# EAGLE design Environmental Module (EAGLE 8.3.0)
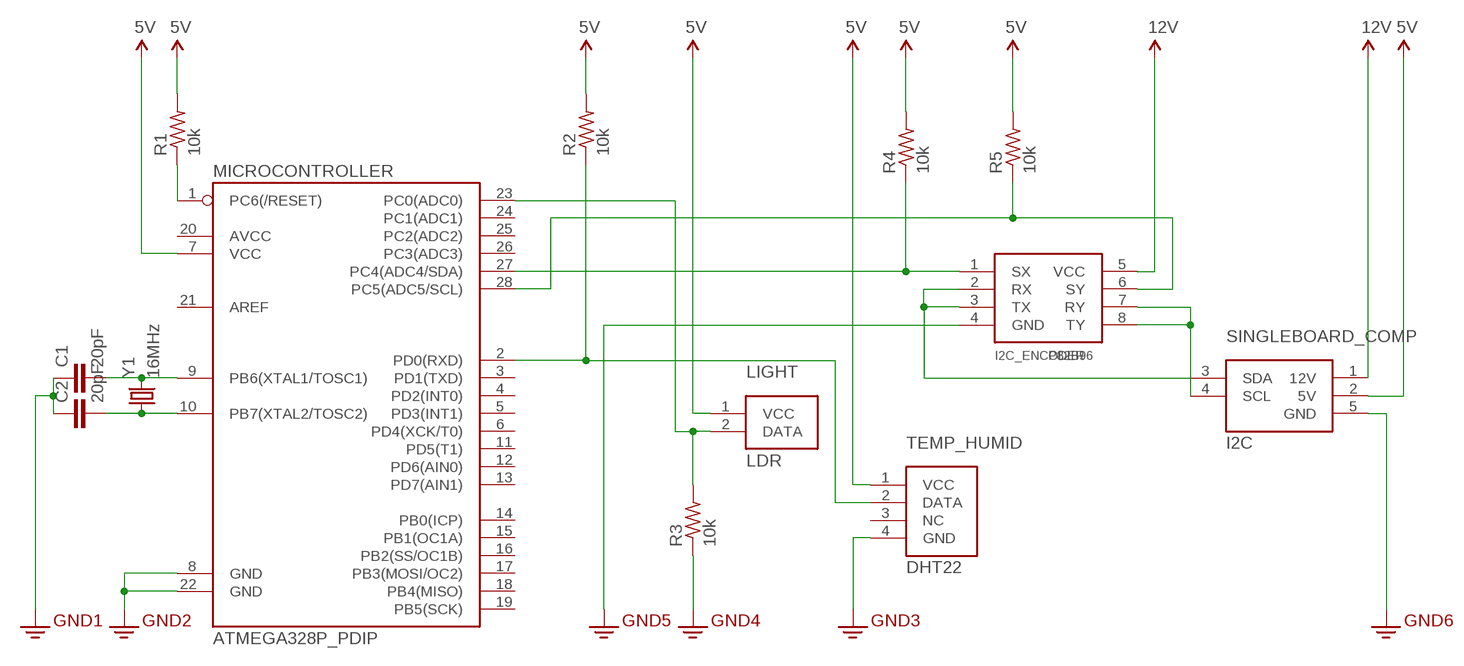
[diagram p0: schematic, sheet 1]

## Parts
C1  20pF  CAPPTH  [CAP-PTH-SMALL]
C2  20pF  CAPPTH  [CAP-PTH-SMALL]
I2C_ENCODER  P82B96  [DIP08]
LIGHT  LDR  [LDR]
MICROCONTROLLER  ATMEGA328P_PDIP  [DIL28-3]
R1  10k  R-US_0204/7  [0204/7]
R2  10k  R-US_0204/7  [0204/7]
R3  10k  R-US_0204/7  [0204/7]
R4  10k  R-US_0204/7  [0204/7]
R5  10k  R-US_0204/7  [0204/7]
SINGLEBOARD_COMP  I2C  [I2C_TERM]
TEMP_HUMID  DHT22  [DHT22]
Y1  16MHz  CRYSTALHC49US  [HC49US]

## Nets
3.3V: C1.1 C2.1 I2C_ENCODER.4(GND) MICROCONTROLLER.8(GND) MICROCONTROLLER.22(GND) R3.1 SINGLEBOARD_COMP.5(GND) TEMP_HUMID.4(GND) ; supply symbol labelled GND2
5V: LIGHT.1(VCC) MICROCONTROLLER.7(VCC) R1.2 R2.2 R4.2 R5.2 SINGLEBOARD_COMP.2(5V) TEMP_HUMID.1(VCC)
12V: I2C_ENCODER.5(VCC) SINGLEBOARD_COMP.1(12V)
N$2: I2C_ENCODER.6(SY) MICROCONTROLLER.28(PC5(ADC5/SCL)) R5.1
N$3: MICROCONTROLLER.1(PC6(/RESET)) R1.1
N$4: I2C_ENCODER.7(RY) I2C_ENCODER.8(TY) SINGLEBOARD_COMP.4(SCL)
N$5: I2C_ENCODER.1(SX) MICROCONTROLLER.27(PC4(ADC4/SDA)) R4.1
N$9: MICROCONTROLLER.2(PD0(RXD)) R2.1 TEMP_HUMID.2(DATA)
N$10: LIGHT.2(DATA) MICROCONTROLLER.23(PC0(ADC0)) R3.2
N$11: I2C_ENCODER.2(RX) I2C_ENCODER.3(TX) SINGLEBOARD_COMP.3(SDA)
N$12: C2.2 MICROCONTROLLER.10(PB7(XTAL2/TOSC2)) Y1.1
N$20: C1.2 MICROCONTROLLER.9(PB6(XTAL1/TOSC1)) Y1.2
Unconnected: MICROCONTROLLER.3(PD1(TXD)) MICROCONTROLLER.4(PD2(INT0)) MICROCONTROLLER.5(PD3(INT1)) MICROCONTROLLER.6(PD4(XCK/T0)) MICROCONTROLLER.11(PD5(T1)) MICROCONTROLLER.12(PD6(AIN0)) MICROCONTROLLER.13(PD7(AIN1)) MICROCONTROLLER.14(PB0(ICP)) MICROCONTROLLER.15(PB1(OC1A)) MICROCONTROLLER.16(PB2(SS/OC1B)) MICROCONTROLLER.17(PB3(MOSI/OC2)) MICROCONTROLLER.18(PB4(MISO)) MICROCONTROLLER.19(PB5(SCK)) MICROCONTROLLER.20(AVCC) MICROCONTROLLER.21(AREF) MICROCONTROLLER.24(PC1(ADC1)) MICROCONTROLLER.25(PC2(ADC2)) MICROCONTROLLER.26(PC3(ADC3)) TEMP_HUMID.3(NC)

## Library data of the parts
C1 C2 = SparkFun-Capacitors:CAP: Capacitor Standard 0603 ceramic capacitor, and 0.1" leaded capacitor.
I2C_ENCODER = 003_P82B96:P82B96: P82B96 - I2C buffer
LIGHT = 000_CropQuant:LDR
MICROCONTROLLER = SparkFun-DigitalIC:ATMEGA328P_PDIP: uC used in the Arduino 32kb flash, 1k EEPROM, 2k SRAM This is the through-hole version of this chip.
R1-R5 = resistor:R-US_: RESISTOR, American symbol
SINGLEBOARD_COMP = 000_CropQuant:I2C
TEMP_HUMID = 000_CropQuant:DHT22
Y1 = SparkFun-FreqCtrl:CRYSTAL: Various standard crystals. Proven footprints.

## Board
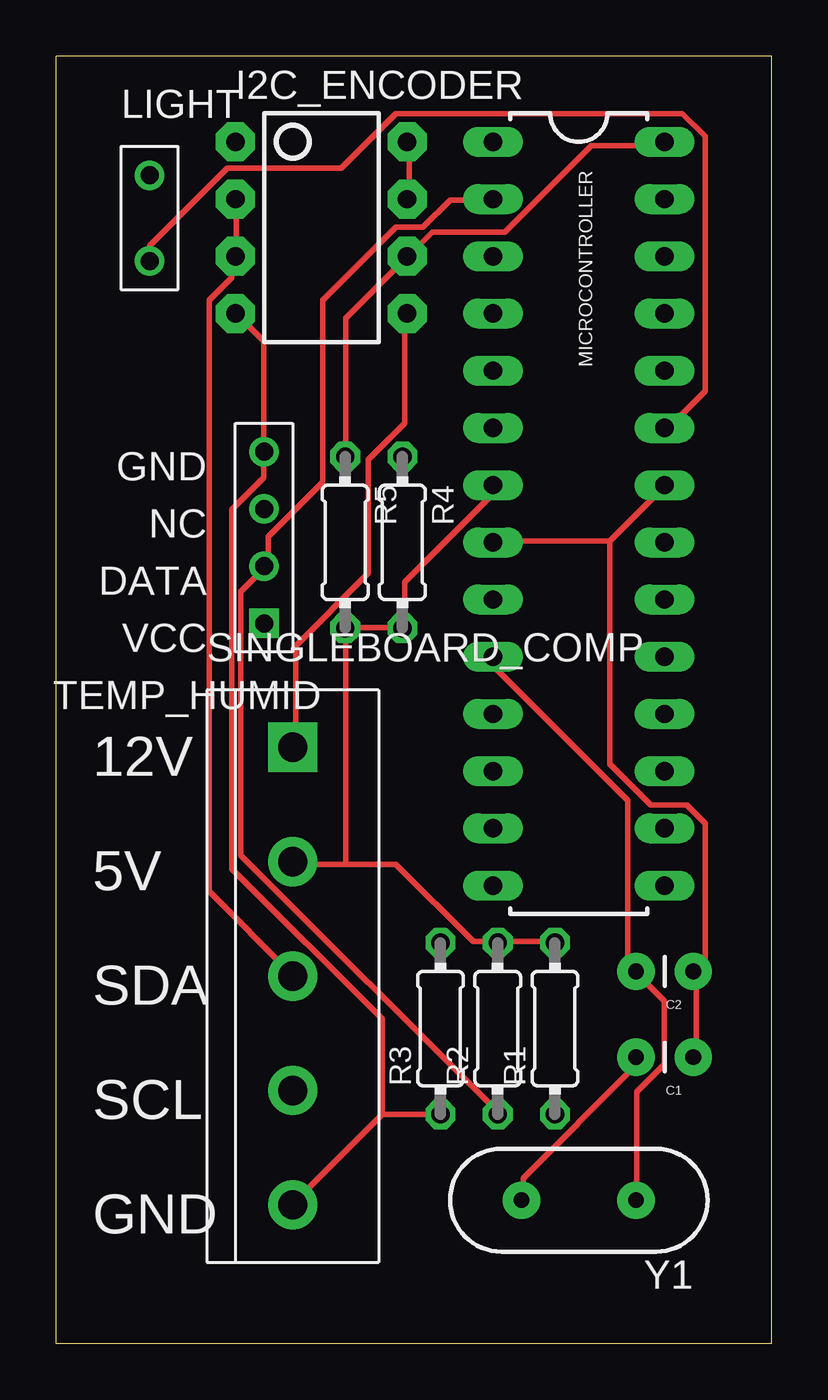
[diagram p1: board, top side]
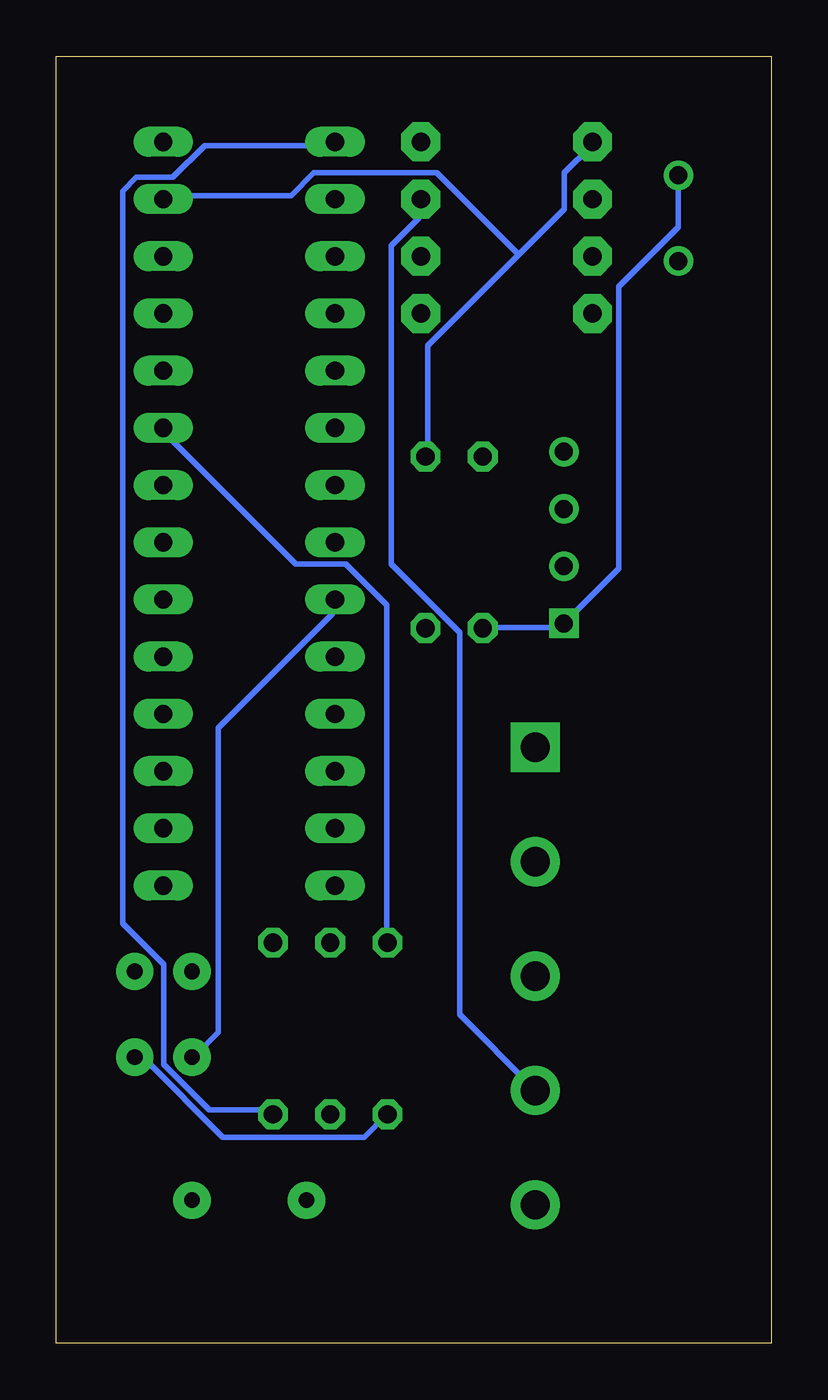
[diagram p2: board, bottom side, seen from below]

Size 31.75 x 57.14 mm. Coordinates in mm from the lower left corner, seen from the top.
Outline: 0,0 31.75,0 31.75,57.14 0,57.14 0,0
Copper layers (1*16): Top 0.035mm / dielectric 1.5mm / Bottom 0.035mm
Design rules "default *": minimum track width 10mil, minimum drill 24mil, track to track 0.15mm, track to pad 0.15mm, pad to pad 0.15mm, via to via 0.15mm, smd to smd 0.15mm, copper to edge 40mil, drill to drill 8mil, minimum pad ring 10mil, minimum via ring 8mil, stop-mask expansion 4mil, vias tented up to drill 0mil, thermal gap 10mil

### Footprints (pad centres in the part's own frame; a part is rotated, then mirrored left to right if it is on the bottom)
CAP-PTH-SMALL = drill 0.7 pad 1.651: 1 0,0; 2 2.54,0
DIP08 = drill 0.813 pad 1.727 octagon: 1 -3.81,-3.81; 2 -1.27,-3.81; 3 1.27,-3.81; 4 3.81,-3.81; 5 3.81,3.81; 6 1.27,3.81; 7 -1.27,3.81; 8 -3.81,3.81
LDR = drill 0.8: 1 0,1.27; 2 0,-2.54
DIL28-3 = drill 0.813 long: 1 -16.51,-3.81; 2 -13.97,-3.81; 3 -11.43,-3.81; 4 -8.89,-3.81; 5 -6.35,-3.81; 6 -3.81,-3.81; 7 -1.27,-3.81; 8 1.27,-3.81; 9 3.81,-3.81; 10 6.35,-3.81; 11 8.89,-3.81; 12 11.43,-3.81; 13 13.97,-3.81; 14 16.51,-3.81; 15 16.51,3.81; 16 13.97,3.81; 17 11.43,3.81; 18 8.89,3.81; 19 6.35,3.81; 20 3.81,3.81; 21 1.27,3.81; 22 -1.27,3.81; 23 -3.81,3.81; 24 -6.35,3.81; 25 -8.89,3.81; 26 -11.43,3.81; 27 -13.97,3.81; 28 -16.51,3.81
0204/7 = drill 0.813 octagon: 1 -3.81,0; 2 3.81,0
I2C_TERM = drill 1.3 pad 2.184 square: 1 0,10.16 | drill 1.3 pad 2.184: 2 0,5.08; 3 0,0; 4 0,-5.08; 5 0,-10.16
DHT22 = drill 0.8 square: 1 0,3.81 | drill 0.8: 2 0,1.27; 3 0,-1.27; 4 0,-3.81
HC49US = drill 0.7 pad 1.651: 1 -2.54,0; 2 2.54,0

### Placement (x,y rotation side)
C1  28.27,12.7 180 top
C2  28.27,16.51 180 top
I2C_ENCODER  11.76,49.53 270 top
LIGHT  4.14,50.59 0 top
MICROCONTROLLER  23.19,36.83 270 top
R1  22.13,13.97 90 top
R2  19.59,13.97 90 top
R3  17.05,13.97 90 top
R4  15.36,35.56 270 top
R5  12.82,35.56 270 top
SINGLEBOARD_COMP  10.49,16.3 0 top
TEMP_HUMID  9.22,35.77 180 top
Y1  23.19,6.35 180 top

### Tracks (layer width: path | path; a pad name or v marks a point on that pad's centre or on a via)
3.3V
  Top 0.254: 24.56,35.61 19.51,35.61 MICROCONTROLLER.8 | 24.56,35.61 26.98,38.03 MICROCONTROLLER.22 | I2C_ENCODER.4 7.99,45.71 9.2,44.49 9.2,39.65 TEMP_HUMID.4 9.2,39.44 9.2,38.43 7.79,37.02 7.79,21.06 14.46,14.4 14.46,10.15 | C1.1 28.39,12.78 28.39,16.42 C2.1 28.39,16.62 28.8,17.02 28.8,23.08 27.99,23.89 26.37,23.89 24.56,25.71 24.56,35.61 | 14.46,10.15 16.88,10.15 R3.1 | 14.46,10.15 10.62,6.32 SINGLEBOARD_COMP.5
  Bottom 0.254: C1.1 28.19,12.58 27.79,12.58 24.35,9.14 18.09,9.14 17.08,10.15 R3.1
5V
  Top 0.254: R1.2 21.93,17.83 19.71,17.83 R2.2 19.51,17.83 18.5,17.83 15.06,21.26 12.84,21.26 | 12.84,21.26 10.62,21.26 SINGLEBOARD_COMP.2 | MICROCONTROLLER.7 19.3,38.03 19.3,37.63 15.47,33.79 15.47,31.77 R4.2 15.26,31.77 12.84,31.77 R5.2 12.84,31.57 12.84,21.26
  Bottom 0.254: R5.2 12.64,31.77 9.41,31.77 TEMP_HUMID.1 9.2,31.97 6.78,34.39 6.78,46.92 4.15,49.54 4.15,51.77 LIGHT.1
12V
  Top 0.254: I2C_ENCODER.5 15.47,45.71 15.47,40.86 13.85,39.24 13.85,34.19 10.62,30.96 10.62,26.52 SINGLEBOARD_COMP.1
N$2
  Top 0.254: R5.1 12.84,39.44 12.84,45.5 15.47,48.13 I2C_ENCODER.6 15.67,48.33 16.68,49.34 19.91,49.34 23.75,53.18 26.98,53.18 MICROCONTROLLER.28
N$3
  Bottom 0.254: MICROCONTROLLER.1 19.51,53.18 25.16,53.18 26.58,51.77 28.19,51.77 28.8,51.16 28.8,18.64 26.98,16.82 26.98,12.38 24.96,10.36 22.13,10.36 R1.1
N$4
  Top 0.254: I2C_ENCODER.7 15.67,50.96 15.67,53.18 I2C_ENCODER.8
  Bottom 0.254: I2C_ENCODER.7 15.67,50.76 15.67,49.95 16.88,48.74 16.88,34.6 13.85,31.57 13.85,14.6 10.62,11.37 SINGLEBOARD_COMP.4
N$5
  Bottom 0.254: 11.22,48.33 9.2,50.35 9.2,51.97 7.99,53.18 I2C_ENCODER.1 | 11.22,48.33 15.26,44.29 15.26,39.44 R4.1 | 11.22,48.33 14.86,51.97 20.31,51.97 21.32,50.96 26.98,50.96 MICROCONTROLLER.27
N$9
  Top 0.254: MICROCONTROLLER.2 19.3,50.76 17.49,50.76 16.27,49.54 15.06,49.54 11.83,46.31 11.83,38.23 9.41,35.81 9.41,34.6 TEMP_HUMID.2 9.2,34.39 8.19,33.38 8.19,21.67 19.51,10.36 R2.1
N$10
  Top 0.254: LIGHT.2 4.15,48.13 4.15,48.74 7.59,52.17 12.64,52.17 15.06,54.59 27.79,54.59 28.8,53.58 28.8,42.27 27.18,40.66 MICROCONTROLLER.23
  Bottom 0.254: R3.2 17.08,17.83 17.08,32.78 18.9,34.6 21.12,34.6 26.98,40.45 MICROCONTROLLER.23
N$11
  Top 0.254: I2C_ENCODER.2 7.99,50.76 7.99,48.33 I2C_ENCODER.3 7.79,48.13 7.79,47.32 6.78,46.31 6.78,20.05 10.42,16.42 SINGLEBOARD_COMP.3
N$12
  Top 0.254: MICROCONTROLLER.10 19.51,30.35 19.51,29.95 25.36,24.09 25.36,16.82 25.57,16.62 C2.2 25.77,16.42 26.98,15.2 26.98,12.38 25.77,11.16 25.77,6.52 Y1.1
N$20
  Top 0.254: Y1.2 20.72,6.52 20.72,7.33 25.57,12.17 25.57,12.58 C1.2
  Bottom 0.254: MICROCONTROLLER.9 19.51,32.98 19.51,32.37 24.56,27.32 24.56,13.79 25.57,12.78 C1.2